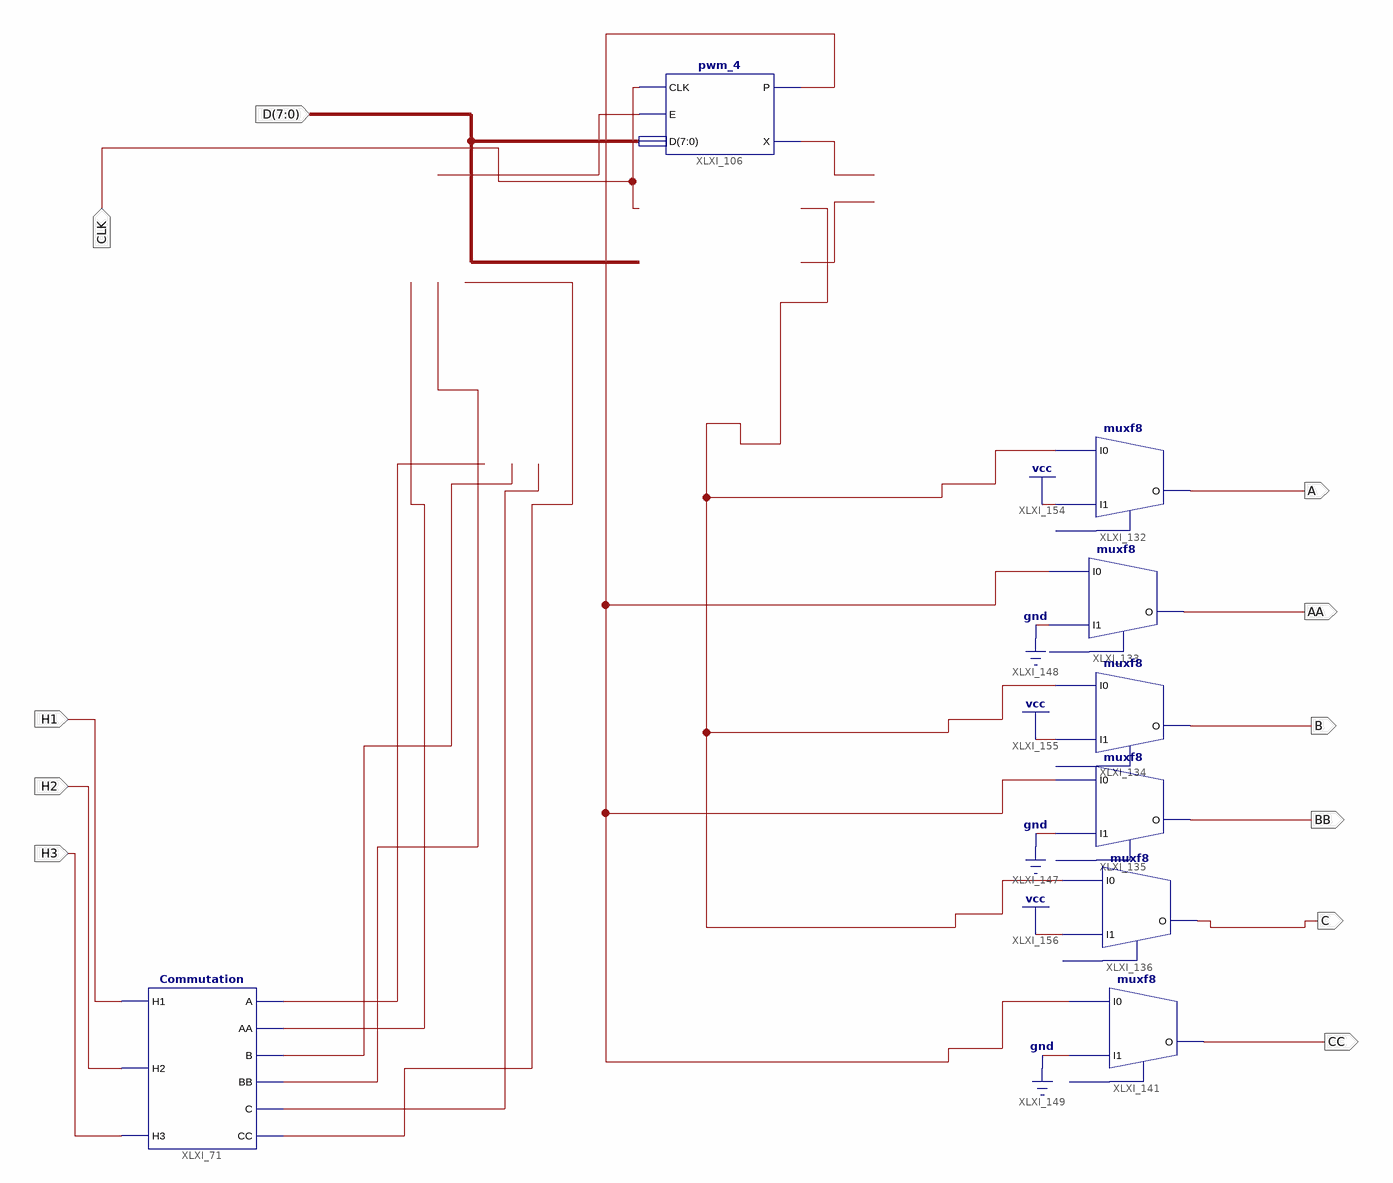
[diagram p0: schematic sheet 1]
// Xilinx ISE schematic MAIN_2.sch (spartan3e) as structural Verilog: 8 symbols, 11 ports
module MAIN_2 (
  input  H3,
  input  H2,
  input  H1,
  input  [7:0] D,
  input  CLK,
  output A,
  output AA,
  output B,
  output BB,
  output C,
  output CC
);

  wire XLXN_168, XLXN_216, XLXN_288, XLXN_289, XLXN_336, XLXN_337, XLXN_338, XLXN_352, XLXN_357, XLXN_362;

  muxf8 XLXI_132 (.I0(XLXN_357), .I1(1'b1), .O(A));  // open: S
  muxf8 XLXI_133 (.I0(XLXN_352), .I1(1'b0), .O(AA));  // open: S
  muxf8 XLXI_134 (.I0(XLXN_357), .I1(1'b1), .O(B));  // open: S
  muxf8 XLXI_135 (.I0(XLXN_352), .I1(1'b0), .O(BB));  // open: S
  muxf8 XLXI_136 (.I0(XLXN_357), .I1(1'b1), .O(C));  // open: S
  muxf8 XLXI_141 (.I0(XLXN_352), .I1(1'b0), .O(CC));  // open: S
  Commutation XLXI_71 (
    .H1(H1), .H2(H2), .H3(H3), .A(XLXN_336), .AA(XLXN_168), .B(XLXN_288), .BB(XLXN_337), .C(XLXN_289),
    .CC(XLXN_338));
  pwm_4 XLXI_106 (.CLK(CLK), .E(XLXN_216), .D(D), .P(XLXN_352), .X(XLXN_362));
endmodule
